# Altium schematic sheet Signal Isolation.SchDoc: UART & Signal Isolation
size 292 x 193 mm; SheetNumber: 1; SheetTotal: 8
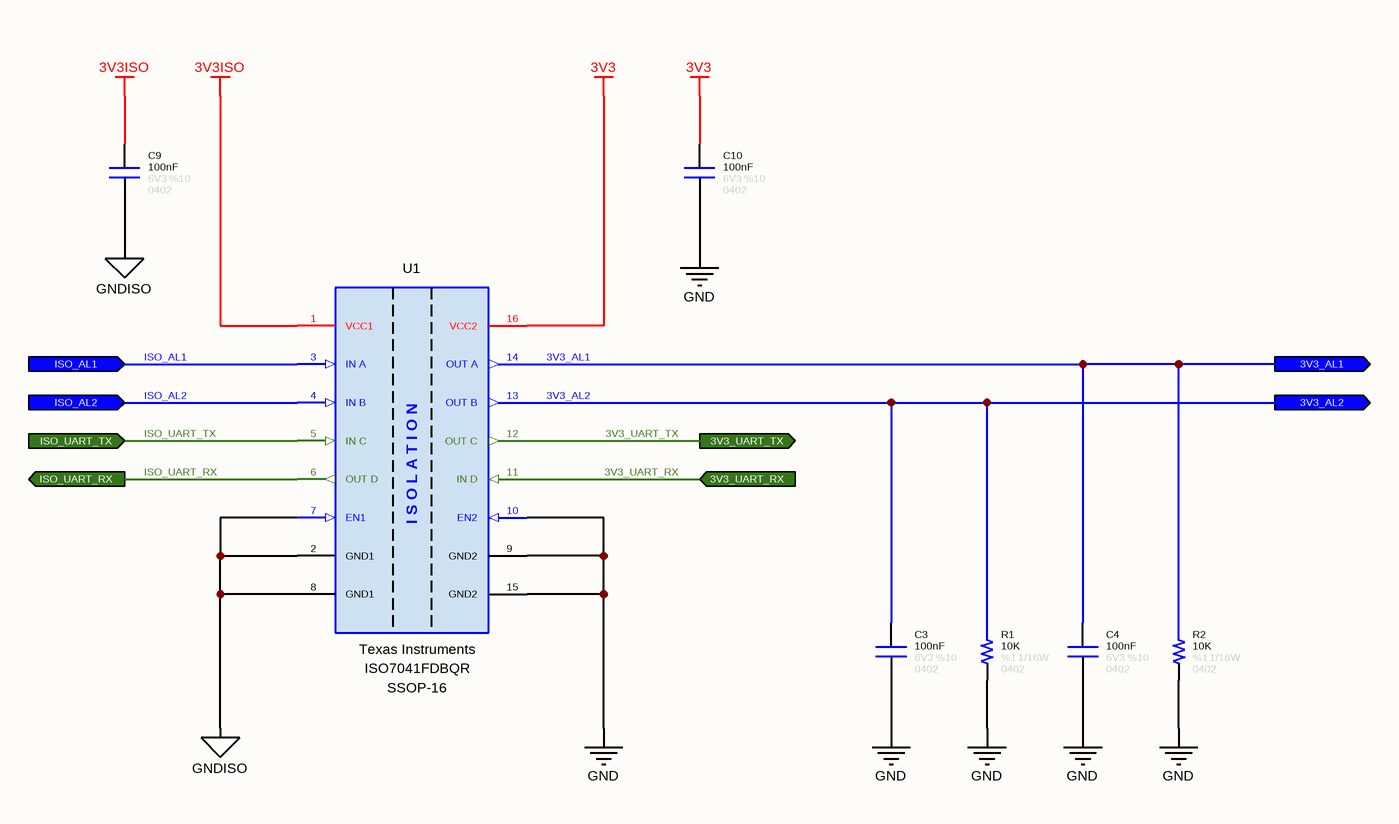
[diagram p0: Signal Isolation.SchDoc]

## Parts
C3  value 100nF  Tolerance: %10  Voltage: 6V3  Case: 0402  [CAPACITOR_0402]  (hidden comment: Capacitor - 100nF [0402] (Ceramic))
C4  value 100nF  Tolerance: %10  Voltage: 6V3  Case: 0402  [CAPACITOR_0402]  (hidden comment: Capacitor - 100nF [0402] (Ceramic))
C9  value 100nF  Tolerance: %10  Voltage: 6V3  Case: 0402  [CAPACITOR_0402]  (hidden comment: Capacitor - 100nF [0402] (Ceramic))
C10  value 100nF  Tolerance: %10  Voltage: 6V3  Case: 0402  [CAPACITOR_0402]  (hidden comment: Capacitor - 100nF [0402] (Ceramic))
R1  value 10K  Tolerance: %1  Case: 0402  Power: 1/16W  [RESISTOR_0402]  (hidden comment: 10K - 0402 - %1 - 1/16W)
R2  value 10K  Tolerance: %1  Case: 0402  Power: 1/16W  [RESISTOR_0402]  (hidden comment: 10K - 0402 - %1 - 1/16W)
U1  Manufacturer Name: Texas Instruments  Manufacturer Part Number: ISO7041FDBQR  [SSOP-16]  (hidden comment: ISO7041)

## Ports
3V3_AL1 (out), 3V3_AL2 (out), 3V3_UART_RX (in), 3V3_UART_TX (out), ISO_AL1 (in), ISO_AL2 (in), ISO_UART_RX (out), ISO_UART_TX (in)

## Nets
3V3: C10.2 U1.16(VCC2)
3V3ISO: C9.2 U1.1(VCC1)
GND: C3.1 C4.1 C10.1 R1.1 R2.1 U1.9(GND2) U1.10(EN2) U1.15(GND2)
GNDISO: C9.1 U1.2(GND1) U1.7(EN1) U1.8(GND1)
3V3_AL1: C4.2 R2.2 U1.14(OUT_A) ; port 3V3_AL1
3V3_AL2: C3.2 R1.2 U1.13(OUT_B) ; port 3V3_AL2
3V3_UART_RX: U1.11(IN_D) ; port 3V3_UART_RX
3V3_UART_TX: U1.12(OUT_C) ; port 3V3_UART_TX
ISO_AL1: U1.3(IN_A) ; port ISO_AL1
ISO_AL2: U1.4(IN_B) ; port ISO_AL2
ISO_UART_RX: U1.6(OUT_D) ; port ISO_UART_RX
ISO_UART_TX: U1.5(IN_C) ; port ISO_UART_TX

## Notes on the sheet
- © 2021 All rights reserved.
  This document may not, in whole or in part, be copied, photocopied, reproduced, translated or converted to any electronic or machine readable from without prior written permission of Mehmet Günce Akkoyun.
  Engineer contact : akkoyun@me.com
- Property of
- Engineer :
- Date :
- Size :
- A4
- Time :
- Project :
- Page :
- /
- Customer :
- Product ID :
- Module ID :
- Version :
- File :
- Revision :
- (in symbol IC - ISO7041) I S O L A T I O N

## Library data of the parts
C3 C4 C9 C10 = Capacitor - 100nF [0402-6V3]: Capacitor - 100nF [0402-6V3] (Ceramic); Manufacturer Name: AVX; Manufacturer Part Number: 04026D104KAT4A; ComponentLink1Description: Mouser; ComponentLink1URL: https://www.mouser.com.tr/ProductDetail/AVX/04026D104KAT4A?qs=sGAEpiMZZMs0AnBnWHyRQPg4iYkCw7IMED%2F4kpqgf7w%3D; ComponentLink2Description: DataSheet; ComponentLink2URL: https://www.mouser.com.tr/datasheet/2/40/cx5r-776519.pdf
R1 R2 = Resistor - 10K [0402]: Thick Film Resistors - SMD 1/16 W 10 KOhm 1%; Manufacturer Name: Vishay; Manufacturer Part Number: CRCW040210K0FKED; ComponentLink1Description: DataSheet; ComponentLink1URL: https://www.mouser.com.tr/datasheet/2/427/dcrcwe3-1762152.pdf; ComponentLink2Description: Mouser; ComponentLink2URL: https://www.mouser.com.tr/ProductDetail/Vishay-Dale/CRCW040210K0FKED?qs=sGAEpiMZZMu61qfTUdNhG2DpbjADlD3GcalbOv9utCY%3D
U1 = IC - ISO7041: Digital Isolators Ultra-low power, ATEX/IECEx-certified, four-channel digital isolator 16-SSOP -55 to 125; Isolation Voltage: 3000 Vrms; Supply Voltage - Min: 2.25 V; Supply Voltage - Max: 3.6 V; Isolation Type: Capacitive Coupling; Operating Supply Current: 115.7 uA; Case: SSOP-16